# Altium schematic sheet Sensors.SchDoc
size 420 x 297 mm; Organization: Develer s.r.l.; Address1: via Mugellese 1/A; Address2: 50019 Campi Bisenzio; Address3: Firenze; Address4: ITALY; Revision: A; SheetNumber: 1; SheetTotal: 1
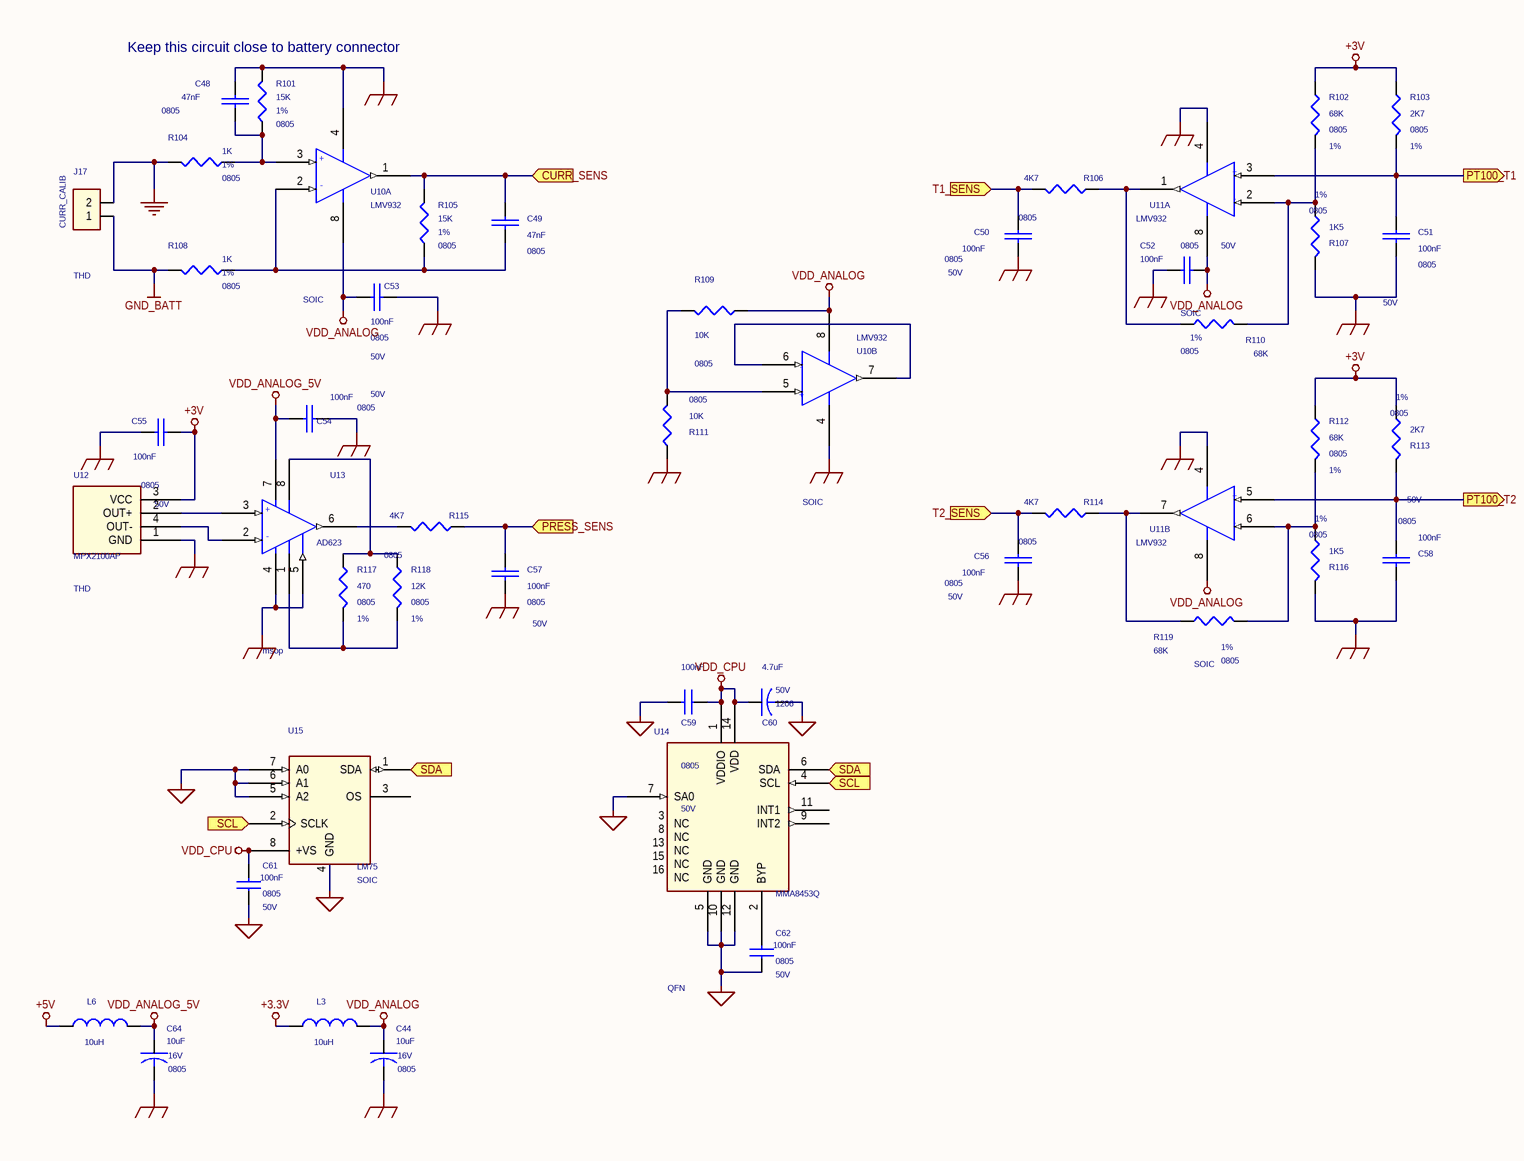
[diagram p0: Sensors.SchDoc]

## Parts
C44  10uF  voltage: 16V  case: 0805  [SM/C_0805]
C48  47nF  case: 0805  [SM/C_0805]
C49  47nF  case: 0805  [SM/C_0805]
C50  100nF  voltage: 50V  case: 0805  [SM/C_0805]
C51  100nF  voltage: 50V  case: 0805  [SM/C_0805]
C52  100nF  voltage: 50V  case: 0805  [SM/C_0805]
C53  100nF  voltage: 50V  case: 0805  [SM/C_0805]
C54  100nF  voltage: 50V  case: 0805  [SM/C_0805]
C55  100nF  voltage: 50V  case: 0805  [SM/C_0805]
C56  100nF  voltage: 50V  case: 0805  [SM/C_0805]
C57  100nF  voltage: 50V  case: 0805  [SM/C_0805]
C58  100nF  voltage: 50V  case: 0805  [SM/C_0805]
C59  100nF  case: 0805  voltage: 50V  [SM/C_0805]
C60  4.7uF  case: 1206  voltage: 50V  [SM/C_1206]
C61  100nF  voltage: 50V  case: 0805  [SM/C_0805]
C62  100nF  voltage: 50V  case: 0805  [SM/C_0805]
C64  10uF  case: 0805  voltage: 16V  [SM/C_0805]
J17  CURR_CALIB  case: THD  [BLKCON.100/VH/TM1SQ/W.100/2]
L3  10uH  [SM/L_1210]
L6  10uH  [SM/L_1210]
R101  15K  case: 0805  1st: 1%  [SM/R_0805]
R102  68K  case: 0805  1st: 1%  [SM/R_0805]
R103  2K7  case: 0805  1st: 1%  [SM/R_0805]
R104  1K  case: 0805  1st: 1%  [SM/R_0805]
R105  15K  case: 0805  1st: 1%  [SM/R_0805]
R106  4K7  case: 0805  [SM/R_0805]
R107  1K5  case: 0805  1st: 1%  [SM/R_0805]
R108  1K  case: 0805  1st: 1%  [SM/R_0805]
R109  10K  case: 0805  [SM/R_0805]
R110  68K  case: 0805  1st: 1%  [SM/R_0805]
R111  10K  case: 0805  [SM/R_0805]
R112  68K  case: 0805  1st: 1%  [SM/R_0805]
R113  2K7  case: 0805  1st: 1%  [SM/R_0805]
R114  4K7  case: 0805  [SM/R_0805]
R115  4K7  case: 0805  [SM/R_0805]
R116  1K5  case: 0805  1st: 1%  [SM/R_0805]
R117  470  case: 0805  1st: 1%  [SM/R_0805]
R118  12K  case: 0805  1st: 1%  [SM/R_0805]
R119  68K  case: 0805  1st: 1%  [SM/R_0805]
U10  LMV932  case: SOIC  [SOG.050/8/WG.244/L.175]  (parts A,B of 2)
U11  LMV932  case: SOIC  [SOG.050/8/WG.244/L.175]  (parts A,B of 2)
U12  MPX2100AP  case: THD  [TO/MPX/4]
U13  AD623  case: msop  [TSSOP/0.65/8]
U14  MMA8453Q  case: QFN  [QNF/16]
U15  LM75  case: SOIC  [SOG.050/8/WG.244/L.200]

## Ports
CURR_SENS (in), PRESS_SENS (in), PT100_T1 (out), PT100_T2 (out), SCL (out), SDA (out), T1_SENS (in), T2_SENS (in)

## Nets
+3.3V: L3.2
+3V: C55.1 R102.1 R103.1 R112.1 R113.2 U12.3(VCC)
+5V: L6.2
GND: C59.2 C60.2 C61.1 C62.1 J17.2 R104.2 U14.5(GND) U14.7(SA0) U14.10(GND) U14.12(GND) U15.4(GND) U15.5(A2) U15.6(A1) U15.7(A0)  [also labelled GND_DIGITAL]
GND_ANALOG: C44.2 C48.2 C50.1 C51.1 C52.2 C53.2 C54.1 C55.2 C56.1 C57.1 C58.2 C64.2 R101.2 R107.1 R111.1 R116.1 U10.4(-VCC) U11.4(-VCC) U12.1(GND) U13.4(-VCC) U13.5(REF)
GND_BATT: J17.1 R108.2
VDD_ANALOG: C44.1 C52.1 C53.1 L3.1 R109.2 U10.8(+VCC) U11.8(+VCC)
VDD_ANALOG_5V: C54.2 C64.1 L6.1 U13.7(+VCC)
VDD_CPU: C59.1 C60.1 C61.2 U14.1(VDDIO) U14.14(VDD) U15.8(+VS)
CURR_SENS: C49.2 R105.2 U10.1(OUTPUT) ; port CURR_SENS
PRESS_SENS: C57.2 R115.2 ; port PRESS_SENS
PT100_T1: C51.2 R103.2 U11.3(+VIN) ; port PT100_T1
PT100_T2: C58.1 R113.1 U11.5(+VIN) ; port PT100_T2
SCL: U14.4(SCL) U15.2(SCLK) ; port SCL
SDA: U14.6(SDA) U15.1(SDA) ; port SDA
T1_SENS: C50.2 R106.1 ; port T1_SENS
T2_SENS: C56.2 R114.1 ; port T2_SENS
NetC48_1: C48.1 R101.1 R104.1 U10.3(+VIN)
NetC49_1: C49.1 R105.1 R108.1 U10.2(-VIN)
NetC62_2: C62.2 U14.2(BYP)
NetR102_2: R102.2 R107.2 R110.2 U11.2(-VIN)
NetR106_2: R106.2 R110.1 U11.1(OUTPUT)
NetR109_1: R109.1 R111.2 U10.5(+VIN)
NetR112_2: R112.2 R116.2 R119.1 U11.6(-VIN)
NetR114_2: R114.2 R119.2 U11.7(OUTPUT)
NetR115_1: R115.1 U13.6(OUT)
NetR117_1: R117.1 R118.1 U13.8(G10/100)
NetR117_2: R117.2 R118.2 U13.1(G10/100)
NetU10_6: U10.6(-VIN) U10.7(OUTPUT)
NetU12_2: U12.2(OUT+) U13.3(+IN)
NetU12_4: U12.4(OUT-) U13.2(-IN)

Not connected (* = marked no-connect by the designer): U14 3(NC) 8(NC) 9(INT2) 11(INT1) 13(NC) 15(NC) 16(NC); U15 3(OS)

## Notes on the sheet
- Keep this circuit close to battery connector
- Title:
- Size:
- Rev:
- A3
- Author:
- Approved:
- File:
- Date:
- Time:
- Sheet
- of
- (in symbol AD621/SO) +; -
- (in symbol LMV358/SO, part A) +; -
- (in symbol LMV358/SO, part B) +; -

## Library data of the parts
C44 C64 = C: COMPGROUP: 3
C48 C49 = C_Dup2: voltage: 50V; COMPGROUP: 4
C50-C58 = C_Dup2: COMPGROUP: 4
C59 C61 C62 = CAP NP: COMPGROUP: 4
C60 = C_0: COMPGROUP: 4
J17 = CON2: COMPGROUP: 4
L3 L6 = INDUCTOR: COMPGROUP: 3; case: 1210
R101-R105 R108 R112 R117-R119 = R_0: COMPGROUP: 4; 2nd: 100ppm
R106 R109 R114 = R_0: 1st: 1%; COMPGROUP: 4; 2nd: 100ppm
R107 R110 R113 R116 = R_0: 2nd: 100ppm; COMPGROUP: 4
R111 R115 = R_0: 1st: 1%; 2nd: 100ppm; COMPGROUP: 4
U10 U11 = LMV358/SO: COMPGROUP: 4
U12 = MPX2100: COMPGROUP: 4
U13 = AD621/SO: COMPGROUP: 4
U14 = MMA8453Q: COMPGROUP: 4
U15 = LM75/SO: COMPGROUP: 4